# Altium project ToucanEye.PrjPcb (part 1 of 4)
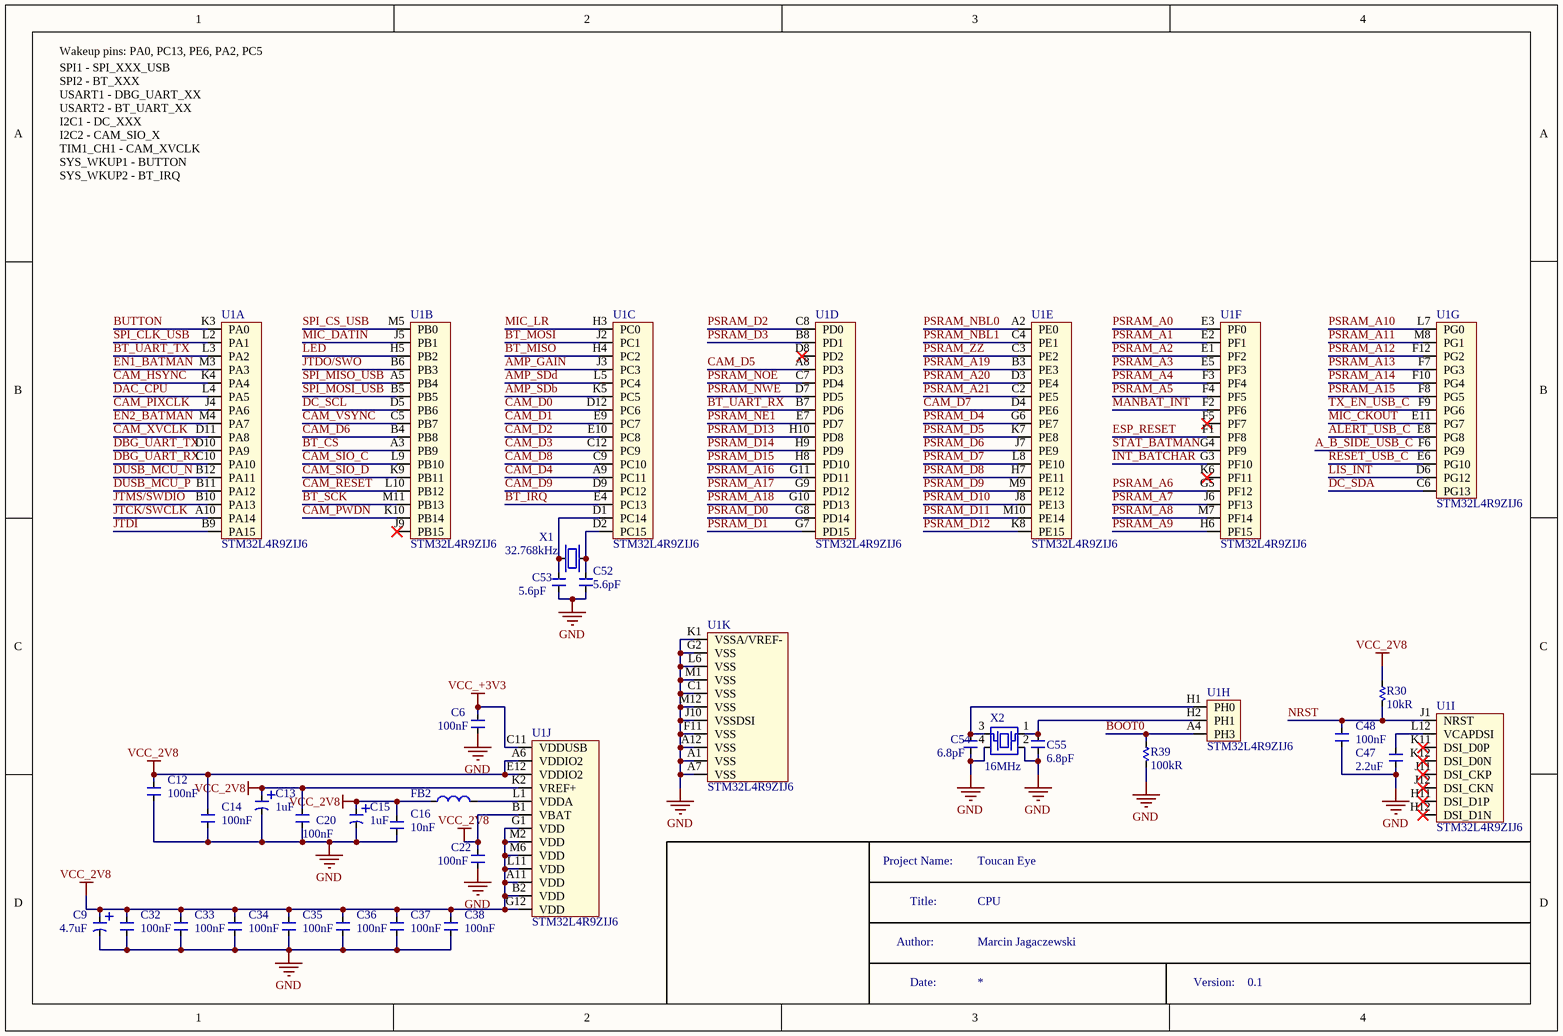
[diagram p0: CPU.SchDoc]
7 sheets, 187 parts. Net scope: global (net labels, ports and power ports of the same name join across sheets).
Board file: ToucanEyePCB.PcbDoc
Sheets:
  CPU.SchDoc
  DC.SchDoc
  TestPoints.SchDoc
  WROOM32.SchDoc
  PSRAM.SchDoc
  AUDIO.SchDoc
  SWITCH.SchDoc

## Sheet CPU.SchDoc: param:Title
size A4; Author: param.Autor; Version: param:Version

### Parts
C6  Capacitance: 100nF  [C_0201]  (hidden comment: C0201_100n_GRM033R6YA104KE14D)
C9  Capacitance: 4.7uF  [C_3216]  (hidden comment: C_4.7u_TANTAL_A_TAJA475K016UNJ)
C12  Capacitance: 100nF  [C_0201]  (hidden comment: C0201_100n_GRM033R6YA104KE14D)
C13  Capacitance: 1uF  [C_3216]  (hidden comment: C_1u_TANTAL_A_293D105X0025A2TE3)
C14  Capacitance: 100nF  [C_0201]  (hidden comment: C0201_100n_GRM033R6YA104KE14D)
C15  Capacitance: 1uF  [C_3216]  (hidden comment: C_1u_TANTAL_A_293D105X0025A2TE3)
C16  Capacitance: 10nF  [C_0201]  (hidden comment: C0201_10n_CGA1A2X7R1A103K030BA)
C20  Capacitance: 100nF  [C_0201]  (hidden comment: C0201_100n_GRM033R6YA104KE14D)
C22  Capacitance: 100nF  [C_0201]  (hidden comment: C0201_100n_GRM033R6YA104KE14D)
C32  Capacitance: 100nF  [C_0201]  (hidden comment: C0201_100n_GRM033R6YA104KE14D)
C33  Capacitance: 100nF  [C_0201]  (hidden comment: C0201_100n_GRM033R6YA104KE14D)
C34  Capacitance: 100nF  [C_0201]  (hidden comment: C0201_100n_GRM033R6YA104KE14D)
C35  Capacitance: 100nF  [C_0201]  (hidden comment: C0201_100n_GRM033R6YA104KE14D)
C36  Capacitance: 100nF  [C_0201]  (hidden comment: C0201_100n_GRM033R6YA104KE14D)
C37  Capacitance: 100nF  [C_0201]  (hidden comment: C0201_100n_GRM033R6YA104KE14D)
C38  Capacitance: 100nF  [C_0201]  (hidden comment: C0201_100n_GRM033R6YA104KE14D)
C47  Capacitance: 2.2uF  [C_0402]  (hidden comment: C0402_2.2u_GRT155R61E225KE13D)
C48  Capacitance: 100nF  [C_0201]  (hidden comment: C0201_100n_GRM033R6YA104KE14D)
C52  Capacitance: 5.6pF  [C_0201]  (hidden comment: C0201_5.6pF_GRM0335C1H5R6BA01D)
C53  Capacitance: 5.6pF  [C_0201]  (hidden comment: C0201_5.6pF_GRM0335C1H5R6BA01D)
C54  Capacitance: 6.8pF  [C_0201]  (hidden comment: C0201_6.8pF_GJM0335C1E6R8CB01D)
C55  Capacitance: 6.8pF  [C_0201]  (hidden comment: C0201_6.8pF_GJM0335C1E6R8CB01D)
FB2  BLM15AG121SN1D  [L_0402]  (value not drawn)
R30  Resistance: 10kR  [R_0201]  (hidden comment: R0201_10k_ERJ-1GNF1002C)
R39  Resistance: 100kR  [R_0201]  (hidden comment: R0201_100k_CRCW0201100KJN-ED)
U1  STM32L4R9ZIJ6  [BGA144C80P12X12_1000X1000X60]  (parts A,B,C,D,E,F,G,H,I,J,K of 11)
X1  Frequency: 32.768kHz  [CRYSTAL_1.6X1]  (hidden comment: ABS05-32.768KHZ-9-T)
X2  Freq: 16MHz  [CRYSTAL_2.5x2]  (hidden comment: CX2520DB16000F0FDFC1)

### Nets
GND: C6.2 C9.2 C12.2 C13.2 C14.2 C15.2 C16.2 C20.2 C22.1 C32.1 C33.1 C34.1 C35.1 C36.1 C37.1 C38.1 C47.1 C48.1 C52.1 C53.2 C54.2 C55.1 R39.1 U1.A1(VSS) U1.A7(VSS) U1.A12(VSS) U1.C1(VSS) U1.F11(VSS) U1.G2(VSS) U1.J10(VSSDSI) U1.K1(VSSA/VREF-) U1.L6(VSS) U1.M1(VSS) U1.M12(VSS) X2.2 X2.4
VCC_2V8: C9.1 C12.1 C13.1 C14.1 C15.1 C16.1 C20.1 C22.2 C32.2 C33.2 C34.2 C35.2 C36.2 C37.2 C38.2 FB2.1(Vcc) R30.2 U1.A6(VDDIO2) U1.A11(VDD) U1.B1(VBAT) U1.B2(VDD) U1.E12(VDDIO2) U1.G1(VDD) U1.G12(VDD) U1.K2(VREF+) U1.L11(VDD) U1.M2(VDD) U1.M6(VDD)
VCC_+3V3: C6.1 U1.C11(VDDUSB)
A_B_SIDE_USB_C: U1.F6(PG9)
ALERT_USB_C: U1.E8(PG8)
AMP_GAIN: U1.J3(PC3)
AMP_~{SDb}: U1.K5(PC5)
AMP_~{SDd}: U1.L5(PC4)
BOOT0: R39.2 U1.A4(PH3)
BT_CS: U1.A3(PB9)
BT_IRQ: U1.E4(PC13)
BT_MISO: U1.H4(PC2)
BT_MOSI: U1.J2(PC1)
BT_SCK: U1.M11(PB13)
BT_UART_RX: U1.B7(PD6)
BT_UART_TX: U1.L3(PA2)
BUTTON: U1.K3(PA0)
CAM_D0: U1.D12(PC6)
CAM_D1: U1.E9(PC7)
CAM_D2: U1.E10(PC8)
CAM_D3: U1.C12(PC9)
CAM_D4: U1.A9(PC11)
CAM_D5: U1.A8(PD3)
CAM_D6: U1.B4(PB8)
CAM_D7: U1.D4(PE6)
CAM_D8: U1.C9(PC10)
CAM_D9: U1.D9(PC12)
CAM_HSYNC: U1.K4(PA4)
CAM_PIXCLK: U1.J4(PA6)
CAM_PWDN: U1.K10(PB14)
CAM_RESET: U1.L10(PB12)
CAM_SIO_C: U1.L9(PB10)
CAM_SIO_D: U1.K9(PB11)
CAM_VSYNC: U1.C5(PB7)
CAM_XVCLK: U1.D11(PA8)
DAC_CPU: U1.L4(PA5)
DBG_UART_RX: U1.C10(PA10)
DBG_UART_TX: U1.D10(PA9)
DC_SCL: U1.D5(PB6)
DC_SDA: U1.C6(PG13)
DUSB_MCU_N: U1.B12(PA11)
DUSB_MCU_P: U1.B11(PA12)
EN1_BATMAN: U1.M3(PA3)
EN2_BATMAN: U1.M4(PA7)
ESP_RESET: U1.F1(PF8)
INT_BATCHAR: U1.G3(PF10)
JTCK/SWCLK: U1.A10(PA14)
JTDI: U1.B9(PA15)
JTDO/SWO: U1.B6(PB3)
JTMS/SWDIO: U1.B10(PA13)
LED: U1.H5(PB2)
LIS_INT: U1.D6(PG12)
MANBAT_INT: U1.F2(PF6)
MIC_CKOUT: U1.E11(PG7)
MIC_DATIN: U1.J5(PB1)
MIC_LR: U1.H3(PC0)
NRST: C48.2 R30.1 U1.J1(NRST)
PSRAM_A0: U1.E3(PF0)
PSRAM_A1: U1.E2(PF1)
PSRAM_A2: U1.E1(PF2)
PSRAM_A3: U1.E5(PF3)
PSRAM_A4: U1.F3(PF4)
PSRAM_A5: U1.F4(PF5)
PSRAM_A6: U1.G5(PF12)
PSRAM_A7: U1.J6(PF13)
PSRAM_A8: U1.M7(PF14)
PSRAM_A9: U1.H6(PF15)
PSRAM_A10: U1.L7(PG0)
PSRAM_A11: U1.M8(PG1)
PSRAM_A12: U1.F12(PG2)
PSRAM_A13: U1.F7(PG3)
PSRAM_A14: U1.F10(PG4)
PSRAM_A15: U1.F8(PG5)
PSRAM_A16: U1.G11(PD11)
PSRAM_A17: U1.G9(PD12)
PSRAM_A18: U1.G10(PD13)
PSRAM_A19: U1.B3(PE3)
PSRAM_A20: U1.D3(PE4)
PSRAM_A21: U1.C2(PE5)
PSRAM_D0: U1.G8(PD14)
PSRAM_D1: U1.G7(PD15)
PSRAM_D2: U1.C8(PD0)
PSRAM_D3: U1.B8(PD1)
PSRAM_D4: U1.G6(PE7)
PSRAM_D5: U1.K7(PE8)
PSRAM_D6: U1.J7(PE9)
PSRAM_D7: U1.L8(PE10)
PSRAM_D8: U1.H7(PE11)
PSRAM_D9: U1.M9(PE12)
PSRAM_D10: U1.J8(PE13)
PSRAM_D11: U1.M10(PE14)
PSRAM_D12: U1.K8(PE15)
PSRAM_D13: U1.H10(PD8)
PSRAM_D14: U1.H9(PD9)
PSRAM_D15: U1.H8(PD10)
PSRAM_NBL0: U1.A2(PE0)
PSRAM_NBL1: U1.C4(PE1)
PSRAM_NE1: U1.E7(PD7)
PSRAM_NOE: U1.C7(PD4)
PSRAM_NWE: U1.D7(PD5)
PSRAM_ZZ: U1.C3(PE2)
RESET_USB_C: U1.E6(PG10)
SPI_CLK_USB: U1.L2(PA1)
SPI_CS_USB: U1.M5(PB0)
SPI_MISO_USB: U1.A5(PB4)
SPI_MOSI_USB: U1.B5(PB5)
STAT_BATMAN: U1.G4(PF9)
TX_EN_USB_C: U1.F9(PG6)
NetC47_2: C47.2 U1.L12(VCAPDSI)
NetC52_2: C52.2 U1.D2(PC15) X1.2
NetC53_1: C53.1 U1.D1(PC14) X1.1
NetC54_1: C54.1 U1.H1(PH0) X2.3
NetC55_2: C55.2 U1.H2(PH1) X2.1
NetFB2_2: FB2.2(Vcc) U1.L1(VDDA)

Not connected (* = marked no-connect by the designer): U1 D8(PD2)* F5(PF7)* H11(DSI_D1P)* H12(DSI_D1N)* J9(PB15)* J11(DSI_CKP)* J12(DSI_CKN)* K6(PF11)* K11(DSI_D0P)* K12(DSI_D0N)*

### Notes on the sheet
- Wakeup pins: PA0, PC13, PE6, PA2, PC5
- SPI1 - SPI_XXX_USB
  SPI2 - BT_XXX
  USART1 - DBG_UART_XX
  USART2 - BT_UART_XX
  I2C1 - DC_XXX
  I2C2 - CAM_SIO_X
  TIM1_CH1 - CAM_XVCLK
  SYS_WKUP1 - BUTTON
  SYS_WKUP2 - BT_IRQ
- Project Name:
- Title:
- CPU
- Toucan Eye
- Author:
- Date:
- Marcin Jagaczewski
- Version:
- 0.1

### Library data of the parts
C6 C12 C14 C20 C22 C32-C38 C48 = C0201_100n_GRM033R6YA104KE14D: Multilayer Ceramic Capacitors MLCC - SMD/SMT 0201 0.10uF 35volts *Derate Voltage/Temp; Manufacturer: Murata; Tolerance: 10%; Dielectric: X5R; Voltage Rating (DC): 35V; Supplier 1: Mouser; Manufacturer Part Number: GRM033R6YA104KE14D; Stock 1: 295799; Pricing 1: 1=0.1, 10=0.061, 50=0.061, 100=0.027, 1000=0.015, 10000=0.01 (USD); Mount: Surface Mount; Case/Package: 0201; Weight: 1.2E-05oz; Case Code (Metric): 0603; Case Code (Imperial): 0201; Min Operating Temperature: -55°C; Max Operating Temperature: 85°C; Packaging: Tape and Reel; Voltage Rating: 35V; Termination: SMD/SMT; Package Quantity: 15000; Length: 0.024inch; Height: 0.3mm; Width: 0.3mm; Thickness: 0.013inch; ComponentLink1URL: http://www.mouser.com/ds/2/281/c02e-2905.pdf; ComponentLink1Description: http://www.mouser.com/ds/2/281/c02e-2905.pdf; ComponentLink2URL: http://search.murata.co.jp/Ceramy/image/img/A01X/partnumbering_e_01.pdf; ComponentLink2Description: http://search.murata.co.jp/Ceramy/image/img/A01X/partnumbering_e_01.pdf; *SCHChecked: *; *PCBChecked: *; Supplier Part Number 1: 81-GRM33R6YA104KE14D
C9 = C_4.7u_TANTAL_A_TAJA475K016UNJ: TANTALUM CHIPS, TAN; Manufacturer: Kyocera AVX; *SCHChecked: 1; Supplier 1: Mouser; Manufacturer Part Number: TAJA475K016UNJ; Stock 1: 7169; Pricing 1: 1=0.11, 10=0.11, 50=0.098, 100=0.088, 1000=0.064, 10000=0.056 (USD); Supplier Part Number 1: 581-TAJA475K016UNJ; *PCBChecked: 1
C13 C15 = C_1u_TANTAL_A_293D105X0025A2TE3: CAP TANT 1UF 25V 20% 1206; Manufacturer: Vishay Sprague; Dielectric Material: Tantalum; ESR (Equivalent Series Resistance): 7.6R; Ripple Current: 100mA; Leakage Current: 500nA; Polarity: Polar; Dissipation Factor: 4%; Voltage Rating (DC): 200kV; *SCHChecked: 1; Supplier 1: Mouser; Manufacturer Part Number: 293D105X0025A2TE3; Stock 1: 4878; Pricing 1: 1=0.17, 10=0.139, 50=0.135, 100=0.131, 1000=0.126, 10000=0.075 (USD); Mount: Surface Mount; Case/Package: 1206; Number of Pins: 2; Case Code (Imperial): 1206; Case Code (Metric): 3216; Min Operating Temperature: -55°C; Max Operating Temperature: 125°C; Tolerance: 20%; Packaging: Tape and Reel; Voltage Rating: 25V; Package Quantity: 2000; Termination: SMD/SMT; Length: 3.2mm; Height: 1.6mm; Width: 1.6mm; Height - Seated (Max): 0.071inch; Depth: 1.6mm; Radiation Hardening: No; REACH SVHC: Unknown; Lead Free: Lead Free; ComponentLink1URL: https://datasheet.ciiva.com/16631/293d-16631739.pdf; ComponentLink1Description: https://datasheet.ciiva.com/16631/293d-16631739.pdf; ComponentLink2URL: https://datasheet.ciiva.com/11245/293d-11245007.pdf; ComponentLink2Description: https://datasheet.ciiva.com/11245/293d-11245007.pdf; ComponentLink3URL: https://datasheet.ciiva.com/22644/1910915-22644415.pdf; ComponentLink3Description: https://datasheet.ciiva.com/22644/1910915-22644415.pdf; ComponentLink4URL: https://datasheet.ciiva.com/16293/293d-16293686.pdf; ComponentLink4Description: https://datasheet.ciiva.com/16293/293d-16293686.pdf; ComponentLink5URL: https://datasheet.ciiva.com/12884/293d-239871-12884008.pdf; ComponentLink5Description: https://datasheet.ciiva.com/12884/293d-239871-12884008.pdf; ComponentLink6URL: https://datasheet.ciiva.com/268/293d-268331.pdf; ComponentLink6Description: https://datasheet.ciiva.com/268/293d-268331.pdf; Supplier Part Number 1: 74-293D105X0025A2TE3; *PCBChecked: 1
C16 = C0201_10n_CGA1A2X7R1A103K030BA: 10000pF ±10% 10V X7R Ceramic Capacitor -55°C ~ 125°C Surface Mount, MLCC 0201 (0603 Metric) 0.024" L x 0.012" W (0.60mm x 0.30mm); Manufacturer: TDK; *SCHChecked: 1; Supplier 1: Mouser; Manufacturer Part Number: CGA1A2X7R1A103K030BA; Stock 1: 84981; Pricing 1: 1=0.11, 10=0.075, 50=0.075, 100=0.03, 1000=0.02, 10000=0.015 (USD); Mount: Surface Mount; Case/Package: 0201; Weight: 6E-06oz; Case Code (Metric): 0603; Case Code (Imperial): 0201; Min Operating Temperature: -55°C; Max Operating Temperature: 125°C; Package Quantity: 15000; Packaging: Tape and Reel; Tolerance: 10%; Voltage Rating: 10V; Dielectric: X7R; Termination: SMD/SMT; Voltage Rating (DC): 10V; Length: 0.024inch; Height: 0.3mm; Width: 0.012inch; Thickness: 0.012inch; ComponentLink1URL: http://www.mouser.com/ds/2/400/lcc_automotive_general_en-843974.pdf; ComponentLink1Description: http://www.mouser.com/ds/2/400/lcc_automotive_general_en-843974.pdf; ComponentLink2URL: http://product.tdk.com/capacitor/mlcc/en/documents/mlcc_automotive_general_en.pdf; ComponentLink2Description: http://product.tdk.com/capacitor/mlcc/en/documents/mlcc_automotive_general_en.pdf; ComponentLink3URL: https://product.tdk.com/info/en/catalog/datasheets/mlcc_automotive_general_en.pdf; ComponentLink3Description: https://product.tdk.com/info/en/catalog/datasheets/mlcc_automotive_general_en.pdf; Supplier Part Number 1: 810-CGA1A2X7R1A103KA; *PCBChecked: 1
C47 = C0402_2.2u_GRT155R61E225KE13D: 2.2µF 25V Ceramic Capacitor X5R 0402 (1005 Metric) 0.039" L x 0.020" W (1.00mm x 0.50mm); Manufacturer: Murata; Tolerance: 10%; *SCHChecked: 1; Supplier 1: Mouser; Manufacturer Part Number: GRT155R61E225KE13D; Stock 1: 15349; Mount: Surface Mount; Case/Package: 0402; Case Code (Metric): 1005; Case Code (Imperial): 0402; Min Operating Temperature: -55°C; Max Operating Temperature: 85°C; Packaging: Cut Tape; Voltage Rating: 25V; Dielectric: X5R; Voltage Rating (DC): 25V; Length: 0.039inch; Width: 0.02inch; Thickness: 0.022inch; ComponentLink1URL: http://search.murata.co.jp/Ceramy/image/img/A01X/G101/ENG/GRT155R61E225KE13-01.pdf; ComponentLink1Description: http://search.murata.co.jp/Ceramy/image/img/A01X/G101/ENG/GRT155R61E225KE13-01.pdf; Supplier Part Number 1: 81-GRT155R61E225KE3D; *PCBChecked: 1
C52 C53 = C0201_5.6pF_GRM0335C1H5R6BA01D: Multilayer Ceramic Capacitors MLCC - SMD/SMT 0201 5.6pF 50volts C0G +/-0.1pF; Manufacturer: Murata; Voltage Rating: 50V; *SCHChecked: 1; Supplier 1: Mouser; Manufacturer Part Number: GRM0335C1H5R6BA01D; Stock 1: 70824; Pricing 1: 1=0.1, 10=0.018, 50=0.018, 100=0.008, 1000=0.005, 10000=0.003 (USD); Mount: Surface Mount; Case/Package: 0201; Case Code (Metric): 0603; Case Code (Imperial): 0201; Min Operating Temperature: -55°C; Max Operating Temperature: 125°C; Package Quantity: 15000; Packaging: Tape and Reel; Voltage Rating (DC): 50V; Dielectric: C0G; Termination: SMD/SMT; Length: 0.6mm; Height: 0.3mm; Width: 0.012inch; Thickness: 0.013inch; Depth: 0.3mm; ComponentLink1URL: https://datasheet.ciiva.com/29538/partnumbering-e-01-29538488.pdf; ComponentLink1Description: https://datasheet.ciiva.com/29538/partnumbering-e-01-29538488.pdf; Supplier Part Number 1: 81-GRM0335C1H5R6BA1D; *PCBChecked: 1
C54 C55 = C0201_6.8pF_GJM0335C1E6R8CB01D: CAP CER 6.8PF 25V NP0 0201; Manufacturer: Murata; Dielectric: C0G; *SCHChecked: 1; Supplier 1: Mouser; Manufacturer Part Number: GJM0335C1E6R8CB01D; Stock 1: 86677; Pricing 1: 1=0.1, 10=0.045, 50=0.045, 100=0.02, 1000=0.011, 10000=0.008 (USD); Mount: Surface Mount; Case/Package: 0201; Case Code (Imperial): 0201; Case Code (Metric): 0603; Min Operating Temperature: -55°C; Max Operating Temperature: 125°C; Package Quantity: 1; Voltage Rating: 25V; Voltage Rating (DC): 25V; Packaging: Tape and Reel; Termination: SMD/SMT; Length: 0.6mm; Height: 0.3mm; Width: 0.3mm; Thickness: 0.013inch; Depth: 0.3mm; Radiation Hardening: No; Lead Free: Lead Free; ComponentLink1URL: https://datasheet.ciiva.com/11611/product-11611316.pdf; ComponentLink1Description: https://datasheet.ciiva.com/11611/product-11611316.pdf; ComponentLink2URL: https://datasheet.ciiva.com/133/partnumbering-e-01-133418.pdf; ComponentLink2Description: https://datasheet.ciiva.com/133/partnumbering-e-01-133418.pdf; ComponentLink3URL: https://datasheet.ciiva.com/133/partnumbering-e-01-133419.pdf; ComponentLink3Description: https://datasheet.ciiva.com/133/partnumbering-e-01-133419.pdf; ComponentLink4URL: https://datasheet.ciiva.com/11611/product-11611254.pdf; ComponentLink4Description: https://datasheet.ciiva.com/11611/product-11611254.pdf; ComponentLink5URL: https://datasheet.ciiva.com/133/partnumbering-e-01-133417.pdf; ComponentLink5Description: https://datasheet.ciiva.com/133/partnumbering-e-01-133417.pdf; Supplier Part Number 1: 81-GJM0335C1E6R8CB01; *PCBChecked: 1
FB2 = BLM15AG121SN1D: MURATA         BLM15AG121SN1D             FERRITE BEAD, 0.25OHM, 500MA, 0402; Material: Steel,Ferrite; Impedance: 120R; Tolerance: 25%; DC Resistance (DCR): 190mR; Current Rating: 550mA; Test Frequency: 100MHz; Number of Lines: 1; Shielding: Unshielded; Supplier 1: Mouser; Manufacturer: Murata; Manufacturer Part Number: BLM15AG121SN1D; Stock 1: 102744; Pricing 1: 1=0.1, 10=0.06, 50=0.06, 100=0.035, 1000=0.025, 10000=0.02 (USD); Case/Package: 0402; Number of Pins: 2; Core Material: Ferrite; Case Code (Metric): 1005; Case Code (Imperial): 0402; Min Operating Temperature: -55°C; Max Operating Temperature: 125°C; Max DC Current: 500mA; Package Quantity: 1; Packaging: Tape and Reel; Max Current Rating: 550mA; Termination: SMD/SMT; DC Current: 500mA; Military Standard: Not; Frequency: 100MHz; Number of Circuits: 1; Length: 1mm; Height: 0.5mm; Width: 0.5mm; Depth: 0.55mm; Radiation Hardening: No; REACH SVHC: No SVHC; Lead Free: Lead Free; ComponentLink1URL: https://datasheet.ciiva.com/34302/1844660-34302798.pdf; ComponentLink1Description: https://datasheet.ciiva.com/34302/1844660-34302798.pdf; ComponentLink2URL: https://datasheet.ciiva.com/18090/getdatasheetpartid-210548-18090179.pdf; ComponentLink2Description: https://datasheet.ciiva.com/18090/getdatasheetpartid-210548-18090179.pdf; ComponentLink3URL: https://datasheet.ciiva.com/11800/0900766b811b5866-11800861.pdf; ComponentLink3Description: https://datasheet.ciiva.com/11800/0900766b811b5866-11800861.pdf; ComponentLink4URL: https://datasheet.ciiva.com/41449/001172160-da-01-en-drossel-0402-120r-1-0x0-5mm-10000st-41449449.pdf; ComponentLink4Description: https://datasheet.ciiva.com/41449/001172160-da-01-en-drossel-0402-120r-1-0x0-5mm-10000st-41449449.pdf; ComponentLink5URL: https://datasheet.ciiva.com/29347/442175-da-01-en-chip-drossel-0402-120r-500ma-1-0x0-5mm-29347874.pdf; ComponentLink5Description: https://datasheet.ciiva.com/29347/442175-da-01-en-chip-drossel-0402-120r-500ma-1-0x0-5mm-29347874.pdf; ComponentLink6URL: https://datasheet.ciiva.com/6212/l0110s0100blm15ag-sn-6212527.pdf; ComponentLink6Description: https://datasheet.ciiva.com/6212/l0110s0100blm15ag-sn-6212527.pdf; ComponentLink7URL: https://datasheet.ciiva.com/14122/blm-series-eng-tds-14122927.pdf; ComponentLink7Description: https://datasheet.ciiva.com/14122/blm-series-eng-tds-14122927.pdf; ComponentLink8URL: https://datasheet.ciiva.com/3081/l0110s0100blm15ag-sn-3081599.pdf; ComponentLink8Description: https://datasheet.ciiva.com/3081/l0110s0100blm15ag-sn-3081599.pdf; ComponentLink9URL: https://datasheet.ciiva.com/3081/l0110s0100blm15ag-sn-3081598.pdf; ComponentLink9Description: https://datasheet.ciiva.com/3081/l0110s0100blm15ag-sn-3081598.pdf; ComponentLink10URL: https://datasheet.ciiva.com/1466/5144-1466741.pdf; ComponentLink10Description: https://datasheet.ciiva.com/1466/5144-1466741.pdf; ComponentLink11URL: https://datasheet.ciiva.com/1466/5144-1466740.pdf; ComponentLink11Description: https://datasheet.ciiva.com/1466/5144-1466740.pdf; ComponentLink12URL: https://datasheet.ciiva.com/17279/l0110s0100blm15ag-sn-17279627.pdf; ComponentLink12Description: https://datasheet.ciiva.com/17279/l0110s0100blm15ag-sn-17279627.pdf; ComponentLink13URL: https://datasheet.ciiva.com/6212/l0110s0100blm15ag-sn-6212533.pdf; ComponentLink13Description: https://datasheet.ciiva.com/6212/l0110s0100blm15ag-sn-6212533.pdf; *SCHChecked: 1; *PCBChecked: 1; Supplier Part Number 1: 81-BLM15AG121SN1D
R30 = R0201_10k_ERJ-1GNF1002C: RESISTOR, 0201, 0.05W, 1%, 10K; Manufacturer: Panasonic ECG; Temperature Coefficient: 200ppm/°C; Power Rating: 50mW; Voltage Rating: 25V; *SCHChecked: 1; Supplier 1: Mouser; Manufacturer Part Number: ERJ-1GNF1002C; Stock 1: 896102; Pricing 1: 1=0.49, 10=0.045, 50=0.045, 100=0.018, 1000=0.013, 10000=0.007 (USD); Mount: Surface Mount; Case/Package: 0201; Number of Pins: 2; Contact Plating: Tin,Matte; Case Code (Metric): 0603; Case Code (Imperial): 0201; Min Operating Temperature: -55°C; Max Operating Temperature: 125°C; Tolerance: 1%; Composition: Thick Film; Packaging: Tape and Reel; Package Quantity: 15000; Number of Terminations: 2; Military Standard: Not; Max Power Dissipation: 50mW; Voltage Rating (DC): 25V; Length: 0.6mm; Height: 0.01inch; Width: 0.012inch; Depth: 0.3mm; Radiation Hardening: No; REACH SVHC: Unknown; Lead Free: Lead Free; ComponentLink1URL: https://datasheet.ciiva.com/16508/aoa0000ce2-16508478.pdf; ComponentLink1Description: https://datasheet.ciiva.com/16508/aoa0000ce2-16508478.pdf; ComponentLink2URL: https://datasheet.ciiva.com/28514/1678782-28514095.pdf; ComponentLink2Description: https://datasheet.ciiva.com/28514/1678782-28514095.pdf; ComponentLink3URL: https://datasheet.ciiva.com/28514/1678782-28514085.pdf; ComponentLink3Description: https://datasheet.ciiva.com/28514/1678782-28514085.pdf; ComponentLink4URL: https://datasheet.ciiva.com/43467/1678782-43467078.pdf; ComponentLink4Description: https://datasheet.ciiva.com/43467/1678782-43467078.pdf; *PCBChecked: 1; Supplier Part Number 1: 667-ERJ-1GNF1002C
R39 = R0201_100k_CRCW0201100KJN-ED: RES SMD 100K OHM 5% 1/20W 0201; Manufacturer: Vishay Dale; Voltage Rating: 30V; Power Rating: 50mW; Temperature Coefficient: 200ppm/°C; *SCHChecked: 1; Supplier 1: Mouser; Manufacturer Part Number: CRCW0201100KJN-ED; Stock 1: 126286; Pricing 1: 1=0.13, 10=0.063, 50=0.063, 100=0.028, 1000=0.017, 10000=0.013 (USD); Case/Package: 0201; Number of Pins: 2; Weight: 6E-06oz; Case Code (Imperial): 0201; Case Code (Metric): 0603; Contact Plating: Tin; Min Operating Temperature: -55°C; Max Operating Temperature: 155°C; Tolerance: 5%; Packaging: Tape and Reel; Package Quantity: 1; Composition: Thick Film; Number of Terminations: 2; Military Standard: Not; Max Power Dissipation: 50mW; Voltage Rating (DC): 30V; Length: 0.6mm; Height: 0.011inch; Width: 0.3mm; Depth: 0.3mm; Radiation Hardening: No; REACH SVHC: Unknown; Lead Free: Lead Free; ComponentLink1URL: https://datasheet.ciiva.com/2498/crcw0201e3-2498781.pdf; ComponentLink1Description: https://datasheet.ciiva.com/2498/crcw0201e3-2498781.pdf; ComponentLink2URL: https://datasheet.ciiva.com/16436/dcrcwe3-16436221.pdf; ComponentLink2Description: https://datasheet.ciiva.com/16436/dcrcwe3-16436221.pdf; ComponentLink3URL: https://datasheet.ciiva.com/2498/crcw0201e3-2498779.pdf; ComponentLink3Description: https://datasheet.ciiva.com/2498/crcw0201e3-2498779.pdf; ComponentLink4URL: https://datasheet.ciiva.com/2498/crcw0201e3-2498780.pdf; ComponentLink4Description: https://datasheet.ciiva.com/2498/crcw0201e3-2498780.pdf; *PCBChecked: 1; Supplier Part Number 1: 71-CRCW0201100KJNED
U1 = STM32L4R9ZIJ6: *SCHChecked: 1; *PCBChecked: *; Supplier: MASTERS; Symbol: STM32L4R9ZIJ6; Symbol supplier: STM32L4R9ZIJ6
X1 = ABS05-32.768KHZ-9-T: 32.768kHz ±20ppm Crystal 9pF 90 kOhm -40°C ~ 85°C  Surface Mount 2-SMD; Manufacturer: Abracon; ESR (Equivalent Series Resistance): 90kR; *SCHChecked: 1; Supplier 1: Mouser; Manufacturer Part Number: ABS05-32.768KHZ-9-T; Stock 1: 11805; Pricing 1: 1=1.6, 10=1.54, 50=1.51, 100=1.29, 1000=1.01, 10000=0.885 (USD); Mount: Surface Mount; Case/Package: SMD/SMT; Number of Pins: 2; Min Operating Temperature: -40°C; Max Operating Temperature: 85°C; Tolerance: 20ppm; Frequency Tolerance: 20ppm; Load Capacitance: 9pF; Packaging: Tape and Reel; Package Quantity: 3000; Termination: SMD/SMT; Series Resistance: 90kR; Length: 1.6mm; Height: 0.02inch; Width: 0.039inch; Depth: 1mm; Radiation Hardening: No; REACH SVHC: No SVHC; Lead Free: Lead Free; ComponentLink1URL: https://datasheet.ciiva.com/12387/abs05-25797-12387306.pdf; ComponentLink1Description: https://datasheet.ciiva.com/12387/abs05-25797-12387306.pdf; ComponentLink2URL: https://datasheet.ciiva.com/48668/abs05-48668569.pdf; ComponentLink2Description: https://datasheet.ciiva.com/48668/abs05-48668569.pdf; ComponentLink3URL: https://datasheet.ciiva.com/16411/abs05-16411147.pdf; ComponentLink3Description: https://datasheet.ciiva.com/16411/abs05-16411147.pdf; ComponentLink4URL: https://datasheet.ciiva.com/6728/abs05-6728951.pdf; ComponentLink4Description: https://datasheet.ciiva.com/6728/abs05-6728951.pdf; ComponentLink5URL: https://datasheet.ciiva.com/6728/abs05-6728952.pdf; ComponentLink5Description: https://datasheet.ciiva.com/6728/abs05-6728952.pdf; ComponentLink6URL: https://datasheet.ciiva.com/6728/abs05-6728953.pdf; ComponentLink6Description: https://datasheet.ciiva.com/6728/abs05-6728953.pdf; Supplier Part Number 1: 815-ABS05-32.768K9T; *PCBChecked: 1
X2 = CX2520DB16000F0FDFC1: Manufacturer: Kyocera AVX; *PCBChecked: 1; Supplier 1: Mouser; Manufacturer Part Number: CX2520DB16000F0FDFC1; Stock 1: 0; Supplier Part Number 1: 581-CX2520DB16F0FDFC; *SCHChecked: 1

## Sheet DC.SchDoc: param:Title
size A4; Author: param.Autor; Version: param:Version
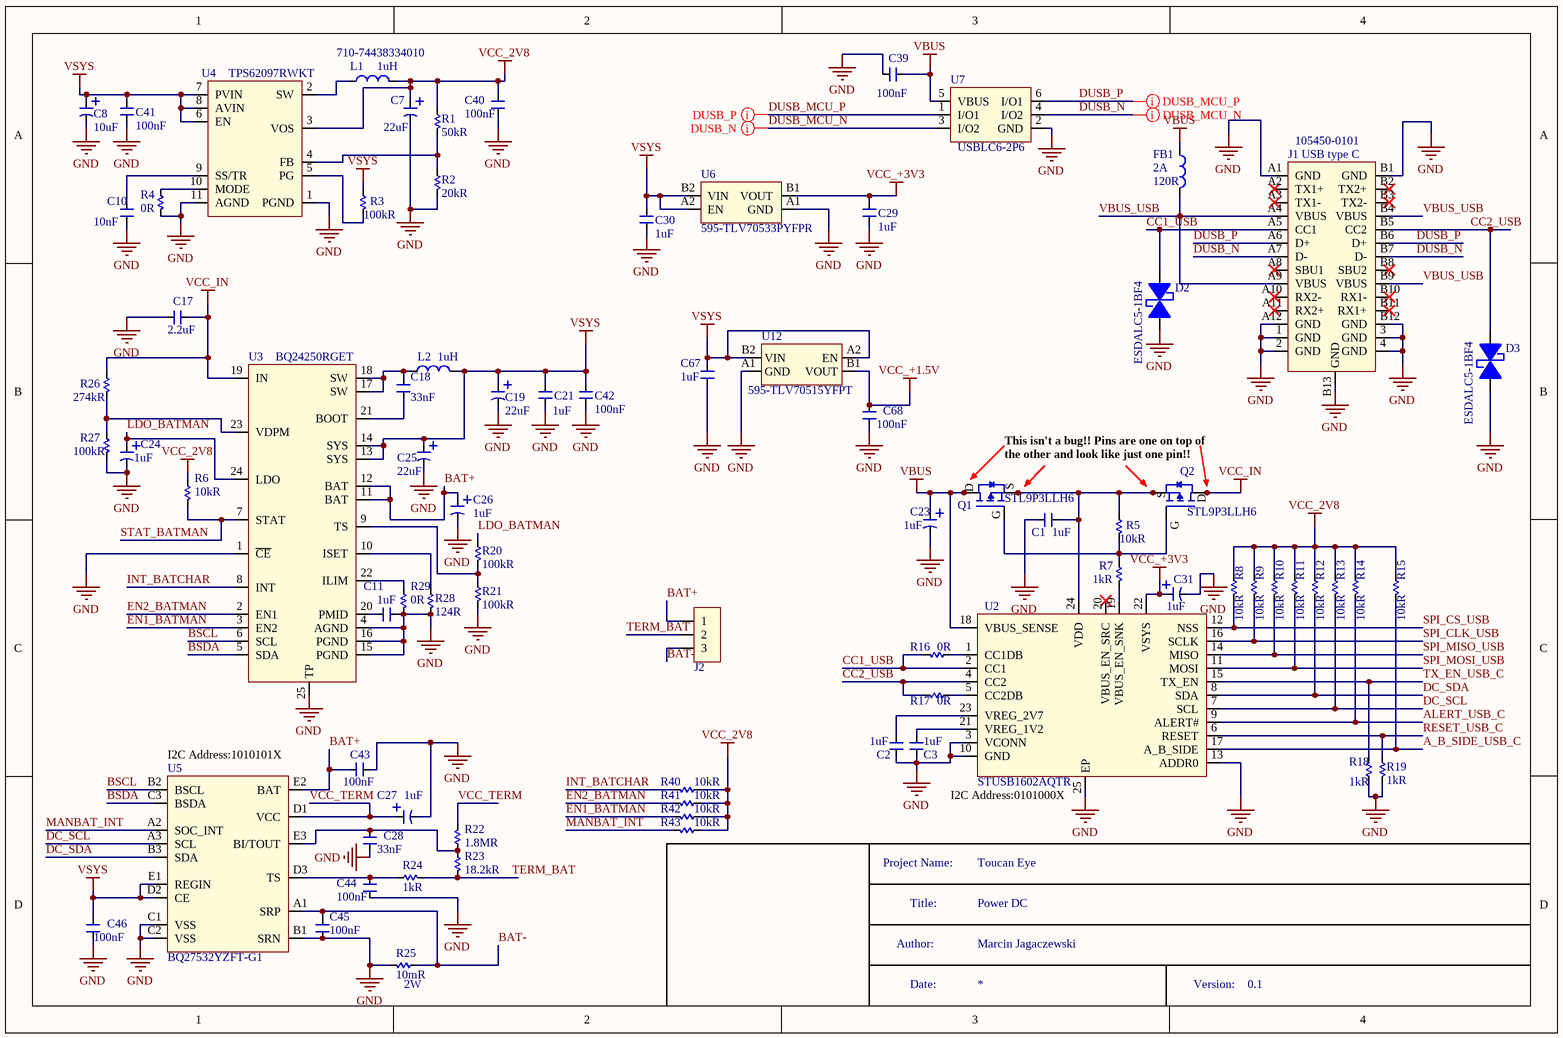
[diagram p1: DC.SchDoc]

### Parts
C1  Capacitance: 1uF  [C_0402]  (hidden comment: C0402_1uF_TMK105BJ105MV-F)
C2  Capacitance: 1uF  [C_0402]  (hidden comment: C0402_1uF_TMK105BJ105MV-F)
C3  Capacitance: 1uF  [C_0402]  (hidden comment: C0402_1uF_TMK105BJ105MV-F)
C7  Capacitance: 22uF  [C_3216]  (hidden comment: C_22u_TANTAL_A_T491A226K006AT)
C8  Capacitance: 10uF  [C_3216]  (hidden comment: C_10u_TANTAL_A_T491A106K010AT7280)
C10  Capacitance: 10nF  [C_0402]  (hidden comment: C0402_10n_C0402C103K4PACTU)
C11  Capacitance: 1uF  [C_0402]  (hidden comment: C0402_1uF_TMK105BJ105MV-F)
C17  Capacitance: 2.2uF  [C_0402]  (hidden comment: C0402_2.2u_GRT155R61E225KE13D)
C18  Capacitance: 33nF  [C_0402]  (hidden comment: C0402_33n_GCM155R71E333KA55D)
C19  Capacitance: 22uF  [C_3216]  (hidden comment: C_22u_TANTAL_A_T491A226K006AT)
C21  Capacitance: 1uF  [C_0402]  (hidden comment: C0402_1uF_TMK105BJ105MV-F)
C23  Capacitance: 1uF  [C_3216]  (hidden comment: C_1u_TANTAL_A_293D105X0025A2TE3)
C24  Capacitance: 1uF  [C_3216]  (hidden comment: C_1u_TANTAL_A_293D105X0025A2TE3)
C25  Capacitance: 22uF  [C_3216]  (hidden comment: C_22u_TANTAL_A_T491A226K006AT)
C26  Capacitance: 1uF  [C_3216]  (hidden comment: C_1u_TANTAL_A_293D105X0025A2TE3)
C27  Capacitance: 1uF  [C_3216]  (hidden comment: C_1u_TANTAL_A_293D105X0025A2TE3)
C28  Capacitance: 33nF  [C_0402]  (hidden comment: C0402_33n_GCM155R71E333KA55D)
C29  Capacitance: 1uF  [C_0402]  (hidden comment: C0402_1uF_TMK105BJ105MV-F)
C30  Capacitance: 1uF  [C_0402]  (hidden comment: C0402_1uF_TMK105BJ105MV-F)
C31  Capacitance: 1uF  [C_3216]  (hidden comment: C_1u_TANTAL_A_293D105X0025A2TE3)
C39  Capacitance: 100nF  [C_0201]  (hidden comment: C0201_100n_GRM033R6YA104KE14D)
C40  Capacitance: 100nF  [C_0201]  (hidden comment: C0201_100n_GRM033R6YA104KE14D)
C41  Capacitance: 100nF  [C_0201]  (hidden comment: C0201_100n_GRM033R6YA104KE14D)
C42  Capacitance: 100nF  [C_0201]  (hidden comment: C0201_100n_GRM033R6YA104KE14D)
C43  Capacitance: 100nF  [C_0201]  (hidden comment: C0201_100n_GRM033R6YA104KE14D)
C44  Capacitance: 100nF  [C_0201]  (hidden comment: C0201_100n_GRM033R6YA104KE14D)
C45  Capacitance: 100nF  [C_0201]  (hidden comment: C0201_100n_GRM033R6YA104KE14D)
C46  Capacitance: 100nF  [C_0201]  (hidden comment: C0201_100n_GRM033R6YA104KE14D)
C67  Capacitance: 1uF  [C_0402]  (hidden comment: C0402_1uF_TMK105BJ105MV-F)
C68  Capacitance: 100nF  [C_0201]  (hidden comment: C0201_100n_GRM033R6YA104KE14D)
D2  ESDALC5-1BF4  [DFN35P60X32-2N]
D3  ESDALC5-1BF4  [DFN35P60X32-2N]
FB1  DC Current: 2A  Impedance: 120R  [L_0603]  (hidden comment: BLM18PG-121SN1D)
J1  105450-0101  Connector Type: USB type C  [USB TYPE C (MOLEX)]
J2  Goldpin 3x1.27mm NDI  [HEADER 3x1.27mm]  (value not drawn)  (net tie, no BOM)
L1  Inductance: 1uH  Supplier Part Number 1: 710-74438334010  [L_3x3]  (hidden comment: L_1u_3x3_74438334010)
L2  Inductance: 1uH  [L_3x3]  (hidden comment: l_1U_3X3_74438336010)
Q1  STL9P3LLH6  [PowerFLAT]
Q2  STL9P3LLH6  [PowerFLAT]
R1  Resistance: 50kR  [R_0402]  (hidden comment: R0402_50k_CRCW040250K0FKED)
R2  Resistance: 20kR  [R_0402]  (hidden comment: R0402_20k_ERJ-2RKF2002X)
R3  Resistance: 100kR  [R_0402]  (hidden comment: R0402_100k_ERJ-2RKF1003X)
R4  Resistance: 0R  [R_0402]  (hidden comment: R0402_0ohm_RC0402FR-070RL)
R5  Resistance: 10kR  [R_0201]  (hidden comment: R0201_10k_ERJ-1GNF1002C)
R6  Resistance: 10kR  [R_0201]  (hidden comment: R0201_10k_ERJ-1GNF1002C)
R7  Resistance: 1kR  [R_0201]  (hidden comment: R0201_1k_ERJ-1GNF1001C)
R8  Resistance: 10kR  [R_0201]  (hidden comment: R0201_10k_ERJ-1GNF1002C)
R9  Resistance: 10kR  [R_0201]  (hidden comment: R0201_10k_ERJ-1GNF1002C)
R10  Resistance: 10kR  [R_0201]  (hidden comment: R0201_10k_ERJ-1GNF1002C)
R11  Resistance: 10kR  [R_0201]  (hidden comment: R0201_10k_ERJ-1GNF1002C)
R12  Resistance: 10kR  [R_0201]  (hidden comment: R0201_10k_ERJ-1GNF1002C)
R13  Resistance: 10kR  [R_0201]  (hidden comment: R0201_10k_ERJ-1GNF1002C)
R14  Resistance: 10kR  [R_0201]  (hidden comment: R0201_10k_ERJ-1GNF1002C)
R15  Resistance: 10kR  [R_0201]  (hidden comment: R0201_10k_ERJ-1GNF1002C)
R16  Resistance: 0R  [R_0201]  (hidden comment: R0201_0_ERJ-1GN0R00C)
R17  Resistance: 0R  [R_0201]  (hidden comment: R0201_0_ERJ-1GN0R00C)
R18  Resistance: 1kR  [R_0201]  (hidden comment: R0201_1k_ERJ-1GNF1001C)
R19  Resistance: 1kR  [R_0201]  (hidden comment: R0201_1k_ERJ-1GNF1001C)
R20  Resistance: 100kR  [R_0402]  (hidden comment: R0402_100k_ERJ-2RKF1003X)
R21  Resistance: 100kR  [R_0402]  (hidden comment: R0402_100k_ERJ-2RKF1003X)
R22  Resistance: 1.8MR  [R_0402]  (hidden comment: R0402_1.8Mohm_ERJ-2GEJ185X)
R23  Resistance: 18.2kR  [R_0402]  (hidden comment: R0402_18.2k_ERJ-2RKF1822X)
R24  Resistance: 1kR  [R_0201]  (hidden comment: R0201_1k_ERJ-1GNF1001C)
R25  Power Rating: 2W  Resistance: 10mR  [R2512]  (hidden comment: R2512_10m_WW25RR010FTL)
R26  Resistance: 274kR  [R_0402]  (hidden comment: R0402_274k_ERJ-2RKF2743X)
R27  Resistance: 100kR  [R_0402]  (hidden comment: R0402_100k_ERJ-2RKF1003X)
R28  Resistance: 124R  [R_0402]  (hidden comment: R0402_124OHM_ERJ-2RKF1240X)
R29  Resistance: 0R  [R_0402]  (hidden comment: R0402_0ohm_RC0402FR-070RL)
R40  Resistance: 10kR  [R_0201]  (hidden comment: R0201_10k_ERJ-1GNF1002C)
R41  Resistance: 10kR  [R_0201]  (hidden comment: R0201_10k_ERJ-1GNF1002C)
R42  Resistance: 10kR  [R_0201]  (hidden comment: R0201_10k_ERJ-1GNF1002C)
R43  Resistance: 10kR  [R_0201]  (hidden comment: R0201_10k_ERJ-1GNF1002C)
U2  STUSB1602AQTR  [QFN24]
U3  BQ24250RGET  [VQFN]
U4  TPS62097RWKT  [VQFN_11]
U5  BQ27532YZFT-G1  [DSBGA-15_PINS]
U6  Supplier Part Number 1: 595-TLV70533PYFPR  [DSBGA]  (hidden comment: TLV70533PYFPR)
U7  USBLC6-2P6  [SOT-666]
U12  Supplier Part Number 1: 595-TLV70515YFPT  [DSBGA]  (hidden comment: TLV70515YFPT)

### Nets
GND: C1.1 C2.1 C3.1 C7.2 C8.2 C10.1 C11.2 C17.2 C19.2 C21.1 C23.2 C24.2 C25.2 C26.2 C27.2 C28.1 C29.1 C30.2 C31.2 C39.1 C40.1 C41.2 C42.1 C43.1 C44.1 C45.2 C46.1 C67.1 C68.1 D2.1 D3.1 J1.1(GND) J1.2(GND) J1.3(GND) J1.4(GND) J1.A1(GND) J1.A12(GND) J1.B1(GND) J1.B12(GND) J1.B13(GND) R2.1 R4.1 R18.2 R19.1 R21.1 R25.1 R27.1 R28.1 R29.1 U2.3(VCONN) U2.10(GND) U2.13(ADDR0) U2.25(EP) U3.1(~{CE}) U3.4(AGND) U3.15(PGND) U3.16(PGND) U3.25(TP) U4.1(PGND) U4.11(AGND) U5.B1(SRN) U5.C1(VSS) U5.C2(VSS) U6.A1(GND) U7.2(GND) U12.A1(GND)
VBUS: C23.1 C39.2 FB1.1(Vcc) Q1.5(D) Q1.6(D) Q1.7(D) Q1.8(D) U2.18(VBUS_SENSE) U7.5(VBUS)
VCC_2V8: C7.1 C40.2 L1.2(Vcc) R1.2 R6.2 R8.2 R9.2 R10.2 R11.2 R12.2 R13.2 R14.2 R15.2 R40.2 R41.2 R42.2 R43.2 U4.3(VOS)
VCC_+1.5V: C68.2 U12.B1(VOUT)
VCC_+3V3: C29.2 C31.1 U2.22(VSYS) U6.B1(VOUT)
VCC_IN: C17.1 Q2.5(D) Q2.6(D) Q2.7(D) Q2.8(D) R26.2 U3.19(IN)
VSYS: C8.1 C19.1 C21.2 C25.1 C30.1 C41.1 C42.2 C46.2 C67.2 L2.2(Vcc) R3.2 U3.13(SYS) U3.14(SYS) U4.6(EN) U4.7(PVIN) U4.8(AVIN) U5.D2(CE) U5.E1(REGIN) U6.A2(EN) U6.B2(VIN) U12.A2(EN) U12.B2(VIN)
A_B_SIDE_USB_C: R15.1 U2.17(A_B_SIDE)
ALERT_USB_C: R14.1 U2.9(ALERT#)
BAT+: C26.1 C43.2 J2.1 U3.11(BAT) U3.12(BAT) U5.E2(BAT)
BAT-: C45.1 J2.3 R25.2 U5.A1(SRP)
BSCL: U3.6(SCL) U5.B2(BSCL)
BSDA: U3.5(SDA) U5.C3(BSDA)
CC1_USB: D2.2 J1.A5(CC1) R16.1 U2.2(CC1)
CC2_USB: D3.2 J1.B5(CC2) R17.1 U2.4(CC2)
DC_SCL: R13.1 U2.7(SCL) U5.A3(SCL)
DC_SDA: R12.1 U2.8(SDA) U5.B3(SDA)
DUSB_MCU_N: U7.3(I/O2)
DUSB_MCU_P: U7.1(I/O1)
DUSB_N: J1.A7(D-) J1.B7(D-) U7.4(I/O2)
DUSB_P: J1.A6(D+) J1.B6(D+) U7.6(I/O1)
EN1_BATMAN: R42.1 U3.3(EN2)
EN2_BATMAN: R41.1 U3.2(EN1)
INT_BATCHAR: R40.1 U3.8(INT)
LDO_BATMAN: C24.1 R20.2 U3.24(LDO)
MANBAT_INT: R43.1 U5.A2(SOC_INT)
RESET_USB_C: R19.2 U2.6(RESET)
SPI_CLK_USB: R9.1 U2.16(SCLK)
SPI_CS_USB: R8.1 U2.12(NSS)
SPI_MISO_USB: R10.1 U2.14(MISO)
SPI_MOSI_USB: R11.1 U2.11(MOSI)
STAT_BATMAN: R6.1 U3.7(STAT)
TERM_BAT: J2.2 R23.1 R24.1
TX_EN_USB_C: R18.1 U2.15(TX_EN)
VBUS_USB: FB1.2(Vcc) J1.A4(VBUS) J1.A9(VBUS) J1.B4(VBUS) J1.B9(VBUS)
VCC_TERM: C27.1 R22.1 U5.D1(VCC)
NetC1_2: C1.2 Q1.1(S) Q1.2(S) Q1.3(S) Q2.1(S) Q2.2(S) Q2.3(S) R5.2 U2.24(VDD)
NetC2_2: C2.2 U2.23(VREG_2V7)
NetC3_2: C3.2 U2.21(VREG_1V2)
NetC10_2: C10.2 U4.9(SS/TR)
NetC11_1: C11.1 U3.20(PMID)
NetC18_1: C18.1 U3.21(BOOT)
NetC18_2: C18.2 L2.1(Vcc) U3.17(SW) U3.18(SW)
NetC28_2: C28.2 R22.2 R23.2 U5.E3(BI/TOUT)
NetC44_2: C44.2 R24.2 U5.D3(TS)
NetL1_1: L1.1(Vcc) U4.2(SW)
NetQ1_4: Q1.4(G) Q2.4(G) R5.1 R7.2
NetR1_1: R1.1 R2.2 U4.4(FB)
NetR3_1: R3.1 U4.5(PG)
NetR4_2: R4.2 U4.10(MODE)
NetR7_1: R7.1 U2.19(VBUS_EN_SNK)
NetR16_2: R16.2 U2.1(CC1DB)
NetR17_2: R17.2 U2.5(CC2DB)
NetR20_1: R20.1 R21.2 U3.9(TS)
NetR26_1: R26.1 R27.2 U3.23(VDPM)
NetR28_2: R28.2 U3.10(ISET)
NetR29_2: R29.2 U3.22(ILIM)

Not connected (* = marked no-connect by the designer): J1 A2(TX1+)* A3(TX1-)* A8(SBU1)* A10(RX2-)* A11(RX2+)* B2(TX2+)* B3(TX2-)* B8(SBU2)* B10(RX1-)* B11(RX1+)*; U2 20(VBUS_EN_SRC)*

### Layout directives
differential pair: DUSB_MCU_N, DUSB_MCU_P, DUSB_N, DUSB_P

### Notes on the sheet
- This isn't a bug!! Pins are one on top of the other and look like just one pin!!
- (near U5) I2C Address:1010101X
- (near U2) I2C Address:0101000X
- Project Name:
- Title:
- Power DC
- Toucan Eye
- Author:
- Date:
- Marcin Jagaczewski
- Version:
- 0.1